# EAGLE design d_counter (EAGLE 7.6.0)

## Sheet 1 of 2
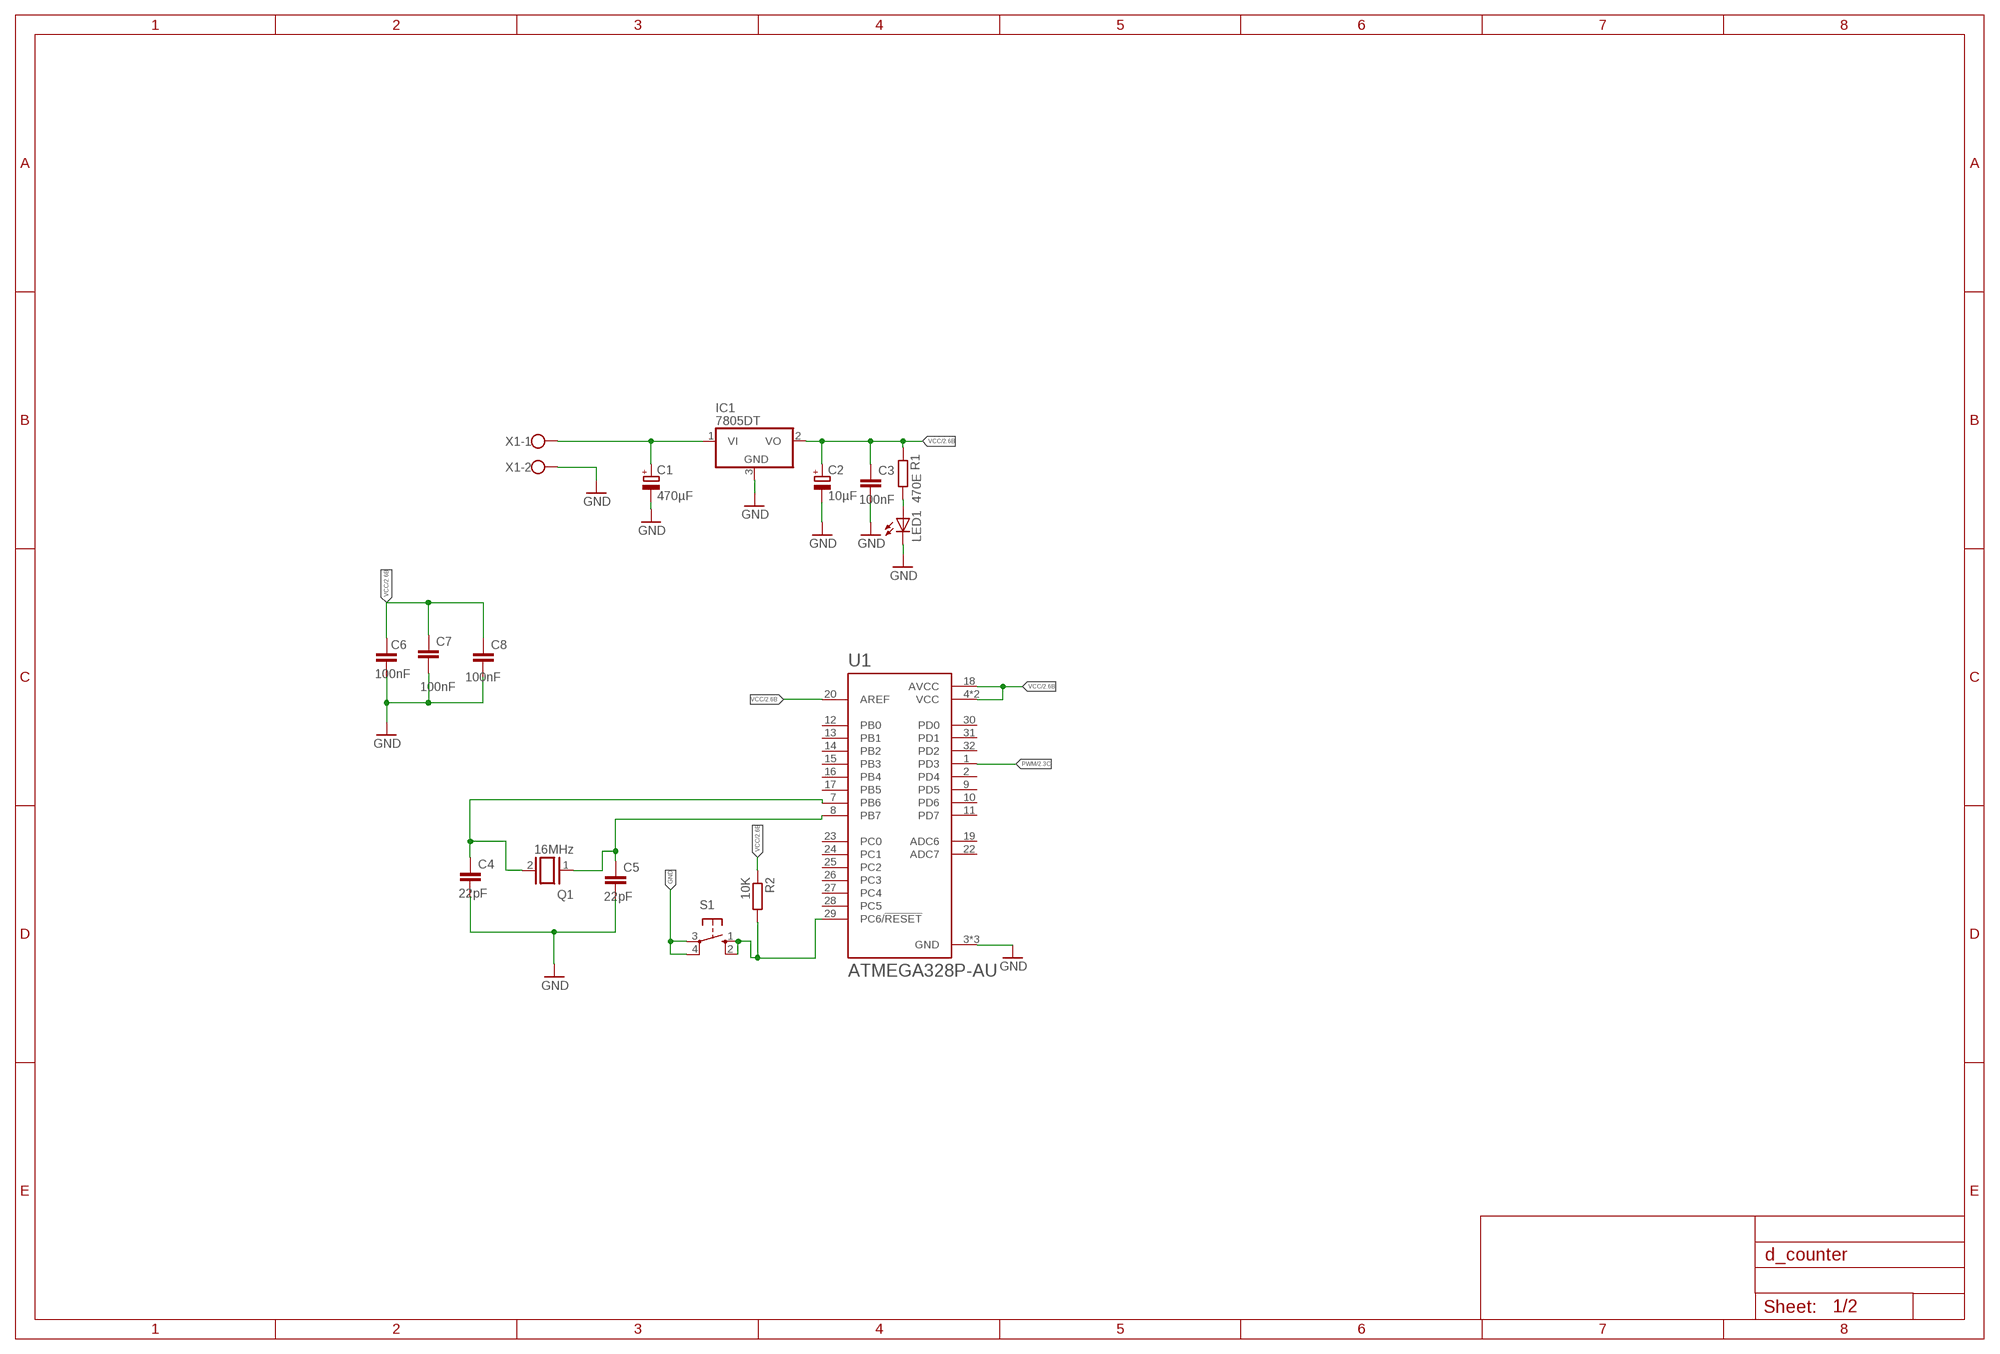
[diagram p0: schematic, sheet 1]

### Parts
C1  470µF  CPOL-EU150CLZ-1010  [150CLZ-1010]
C2  10µF  CPOL-EU150CLZ-1010  [150CLZ-1010]
C3  100nF  C-EUC1206  [C1206]
C4  22pF  C-EUC1206  [C1206]
C5  22pF  C-EUC1206  [C1206]
C6  100nF  C-EUC1206  [C1206]
C7  100nF  C-EUC1206  [C1206]
C8  100nF  C-EUC1206  [C1206]
IC1  7805DT  [TO252]
LED1  LEDSMT1206  [1206]
Q1  16MHz  XTAL/S  [QS]
R1  470E  R-EU_M1206  [M1206]
R2  10K  R-EU_R1206  [R1206]
S1  10-XX  [B3F-10XX]
U1  ATMEGA328P-AU  [QFP80P900X900X120-32N]
X1  W237-102  [W237-102]

### Nets
GND: C1.- C2.- C3.2 C4.2 C5.2 C6.2 C7.2 C8.2 IC1.3(GND) LED1.C S1.3(P) S1.4(P1) U1.3(GND) U1.5(GND) U1.21(GND) X1.2 ; also sheet 2
N$1: C1.+ IC1.1(VI) X1.1
N$2: LED1.A R1.2
N$3: C4.1 Q1.2 U1.7(PB6)
N$4: C5.1 Q1.1 U1.8(PB7)
N$6: R2.2 S1.1(S) S1.2(S1) U1.29(PC6/!RESET)
PWM: U1.1(PD3) ; also sheet 2
VCC: C2.+ C3.1 C6.1 C7.1 C8.1 IC1.2(VO) R1.1 R2.1 U1.4(VCC) U1.6(VCC) U1.18(AVCC) U1.20(AREF) ; also sheet 2
Unconnected: U1.2(PD4) U1.9(PD5) U1.10(PD6) U1.11(PD7) U1.12(PB0) U1.13(PB1) U1.14(PB2) U1.15(PB3) U1.16(PB4) U1.17(PB5) U1.19(ADC6) U1.22(ADC7) U1.23(PC0) U1.24(PC1) U1.25(PC2) U1.26(PC3) U1.27(PC4) U1.28(PC5) U1.30(PD0) U1.31(PD1) U1.32(PD2)

## Sheet 2 of 2
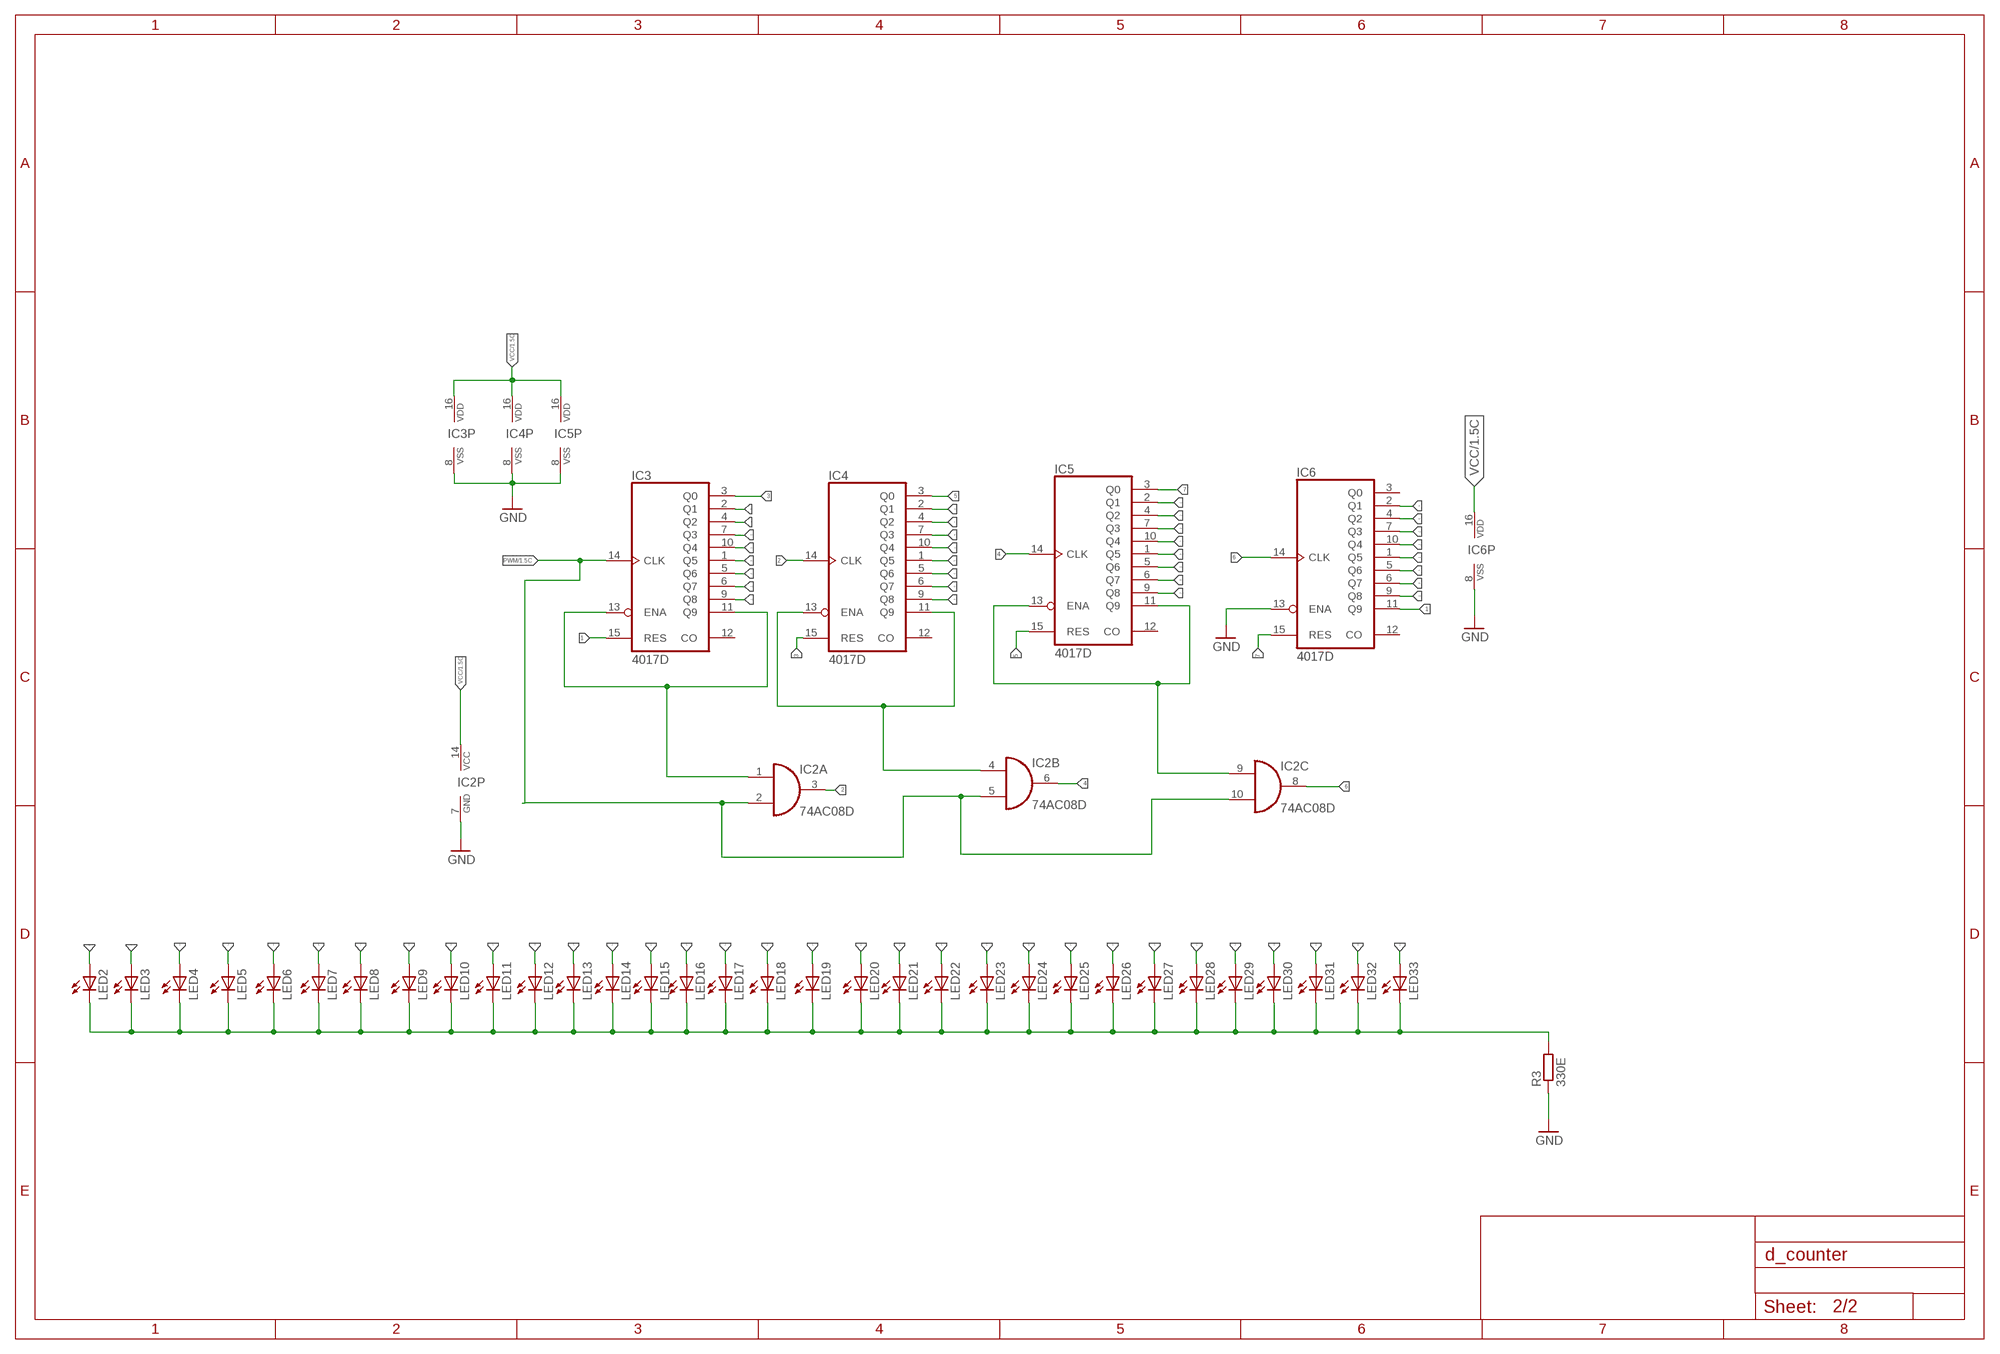
[diagram p1: schematic, sheet 2]

### Parts
IC2  74AC08D  [SO14]
IC3  4017D  [SO16]
IC4  4017D  [SO16]
IC5  4017D  [SO16]
IC6  4017D  [SO16]
LED2  LEDSML1206  [SML1206]
LED3  LEDSML1206  [SML1206]
LED4  LEDSML1206  [SML1206]
LED5  LEDSML1206  [SML1206]
LED6  LEDSML1206  [SML1206]
LED7  LEDSML1206  [SML1206]
LED8  LEDSML1206  [SML1206]
LED9  LEDSML1206  [SML1206]
LED10  LEDSML1206  [SML1206]
LED11  LEDSML1206  [SML1206]
LED12  LEDSML1206  [SML1206]
LED13  LEDSML1206  [SML1206]
LED14  LEDSML1206  [SML1206]
LED15  LEDSML1206  [SML1206]
LED16  LEDSML1206  [SML1206]
LED17  LEDSML1206  [SML1206]
LED18  LEDSML1206  [SML1206]
LED19  LEDSML1206  [SML1206]
LED20  LEDSML1206  [SML1206]
LED21  LEDSML1206  [SML1206]
LED22  LEDSML1206  [SML1206]
LED23  LEDSML1206  [SML1206]
LED24  LEDSML1206  [SML1206]
LED25  LEDSML1206  [SML1206]
LED26  LEDSML1206  [SML1206]
LED27  LEDSML1206  [SML1206]
LED28  LEDSML1206  [SML1206]
LED29  LEDSML1206  [SML1206]
LED30  LEDSML1206  [SML1206]
LED31  LEDSML1206  [SML1206]
LED32  LEDSML1206  [SML1206]
LED33  LEDSML1206  [SML1206]
R3  330E  R-EU_R1206  [R1206]

### Nets
1: IC3.15(RES) IC6.11(Q9)
2: IC2.3(A:O) IC4.14(CLK)
3: IC3.3(Q0) IC4.15(RES)
4: IC2.6(B:O) IC5.14(CLK)
5: IC4.3(Q0) IC5.15(RES)
6: IC2.8(C:O) IC6.14(CLK)
7: IC5.3(Q0) IC6.15(RES)
8: IC3.2(Q1) LED2.A
9: IC3.4(Q2) LED3.A
10: IC3.7(Q3) LED4.A
11: IC3.10(Q4) LED5.A
12: IC3.1(Q5) LED6.A
13: IC3.5(Q6) LED7.A
14: IC3.6(Q7) LED8.A
15: IC3.9(Q8) LED9.A
16: IC4.2(Q1) LED10.A
17: IC4.4(Q2) LED11.A
18: IC4.7(Q3) LED12.A
19: IC4.10(Q4) LED13.A
20: IC4.1(Q5) LED14.A
21: IC4.5(Q6) LED15.A
22: IC4.6(Q7) LED16.A
23: IC4.9(Q8) LED17.A
24: IC5.2(Q1) LED18.A
25: IC5.4(Q2) LED19.A
26: IC5.7(Q3) LED20.A
27: IC5.10(Q4) LED21.A
28: IC5.1(Q5) LED22.A
29: IC5.5(Q6) LED23.A
30: IC5.6(Q7) LED24.A
31: IC5.9(Q8) LED25.A
32: IC6.2(Q1) LED26.A
33: IC6.4(Q2) LED27.A
34: IC6.7(Q3) LED28.A
35: IC6.10(Q4) LED29.A
36: IC6.1(Q5) LED30.A
37: IC6.5(Q6) LED31.A
38: IC6.6(Q7) LED32.A
39: IC6.9(Q8) LED33.A
GND: IC2.7(P:GND) IC3.8(VSS) IC4.8(VSS) IC5.8(VSS) IC6.8(VSS) IC6.13(ENA) R3.1 ; also sheet 1
N$5: IC2.1(A:I0) IC3.11(Q9) IC3.13(ENA)
N$7: IC2.4(B:I0) IC4.11(Q9) IC4.13(ENA)
N$9: IC2.9(C:I0) IC5.11(Q9) IC5.13(ENA)
N$15: LED2.C LED3.C LED4.C LED5.C LED6.C LED7.C LED8.C LED9.C LED10.C LED11.C LED12.C LED13.C LED14.C LED15.C LED16.C LED17.C LED18.C LED19.C LED20.C LED21.C LED22.C LED23.C LED24.C LED25.C LED26.C LED27.C LED28.C LED29.C LED30.C LED31.C LED32.C LED33.C R3.2
PWM: IC2.2(A:I1) IC2.5(B:I1) IC2.10(C:I1) IC3.14(CLK) ; also sheet 1
VCC: IC2.14(P:VCC) IC3.16(VDD) IC4.16(VDD) IC5.16(VDD) IC6.16(VDD) ; also sheet 1
Unconnected: IC2.11(D:O) IC2.12(D:I0) IC2.13(D:I1) IC3.12(CO) IC4.12(CO) IC5.12(CO) IC6.3(Q0) IC6.12(CO)

## Library data of the parts
C1 C2 = resistor:CPOL-EU: POLARIZED CAPACITOR, European symbol
C3-C8 = rcl:C-EU: CAPACITOR, European symbol
IC1 = linear:78*: Positive VOLTAGE REGULATOR Source: http://cache.national.com/ds/LM/LM78L05.pdf http://www.fairchildsemi.com/ds/LM/LM7805.pdf
IC2 = 74xx-eu:74*08: Quad 2-input AND gate
IC3-IC6 = 40xx:4017: COUNTER/DIVIDER
LED1-LED33 = led:LED: LED OSRAM: - CHIPLED LG R971, LG N971, LY N971, LG Q971, LY Q971, LO R971, LY R971 LH N974, LH R974 LS Q976, LO Q976, LY Q976 LO Q996 - Hyper CHIPLED LW Q18S LB Q993, LB Q99A, LB R99A - SideLED LS A670, LO A670, LY A670, LG A670, LP A670 LB A673, LV A673, LT A673, LW A673 LH A674 LY A675 LS A676, LA A676, LO A676, LY A676, LW A676 LS A679, LY A679, LG A679 - Hyper Micro SIDELED® LS Y876, LA Y876, LO Y876, LY Y876 LT Y87S - SmartLED LW L88C, LW L88S LB L89C, LB L89S, LG L890 LS L89K, LO L89K, LY L89K LS L896, LA L896, LO L896, LY L896 - TOPLED LS T670, LO T670, LY T670, LG T670, LP T670 LSG T670, LSP T670, LSY T670, LOP T670, LYG T670 LG T671, LOG T671, LSG T671 LB T673, LV T673, LT T673, LW T673 LH T674 LS T676, LA T676, LO T676, LY T676, LB T676, LH T676, LSB T676, LW T676 LB T67C, LV T67C, LT T67C, LS T67K, LO T67K, LY T67K, LW E67C LS E67B, LA E67B, LO E67B, LY E67B, LB E67C, LV E67C, LT E67C LW T67C LS T679, LY T679, LG T679 LS T770, LO T770, LY T770, LG T770, LP T770 LB T773, LV T773, LT T773, LW T773 LH T774 LS E675, LA E675, LY E675, LS T675 LS T776, LA T776, LO T776, LY T776, LB T776 LHGB T686 LT T68C, LB T68C - Hyper Mini TOPLED® LB M676 - Mini TOPLED Santana® LG M470 LS M47K, LO M47K, LY M47K Source: http://www.osram.convergy.de LUXEON: - LUMILED® LXK2-PW12-R00, LXK2-PW12-S00, LXK2-PW14-U00, LXK2-PW14-V00 LXK2-PM12-R00, LXK2-PM12-S00, LXK2-PM14-U00 LXK2-PE12-Q00, LXK2-PE12-R00, LXK2-PE12-S00, LXK2-PE14-T00, LXK2-PE14-U00 LXK2-PB12-K00, LXK2-PB12-L00, LXK2-PB12-M00, LXK2-PB14-N00, LXK2-PB14-P00, LXK2-PB14-Q00 LXK2-PR12-L00, LXK2-PR12-M00, LXK2-PR14-Q00, LXK2-PR14-R00 LXK2-PD12-Q00, LXK2-PD12-R00, LXK2-PD12-S00 LXK2-PH12-R00, LXK2-PH12-S00 LXK2-PL12-P00, LXK2-PL12-Q00, LXK2-PL12-R00 Source: www.luxeon.com KINGBRIGHT: KA-3528ASYC Source: www.kingbright.com
Q1 = special:XTAL/S: CRYSTAL
R1 = resistor:R-EU_: RESISTOR, European symbol
R2 R3 = rcl:R-EU_: RESISTOR, European symbol
S1 = switch-omron:10-XX: OMRON SWITCH; MPN: B3F-1000; OC_FARNELL: 176432; OC_NEWARK: 36M3542
U1 = ATMEGA328P-AU:ATMEGA328P-AU: ATmega Series 20 MHz 32 KB Flash 2 KB SRAM 8-Bit Microcontroller - TQFP-32; AVAILABILITY: Unavailable; DESCRIPTION: Microcontroller Mcu, 8 Bit, Atmega, 20mhz, Tqfp-32; MF: Microchip; MP: ATMEGA328P-AU; PACKAGE: TQFP-32 Microchip; PRICE: None
X1 = con-wago-500:W237-102: WAGO SCREW CLAMP; MPN: 237-102; OC_FARNELL: unknown; OC_NEWARK: 70K9898

## Board
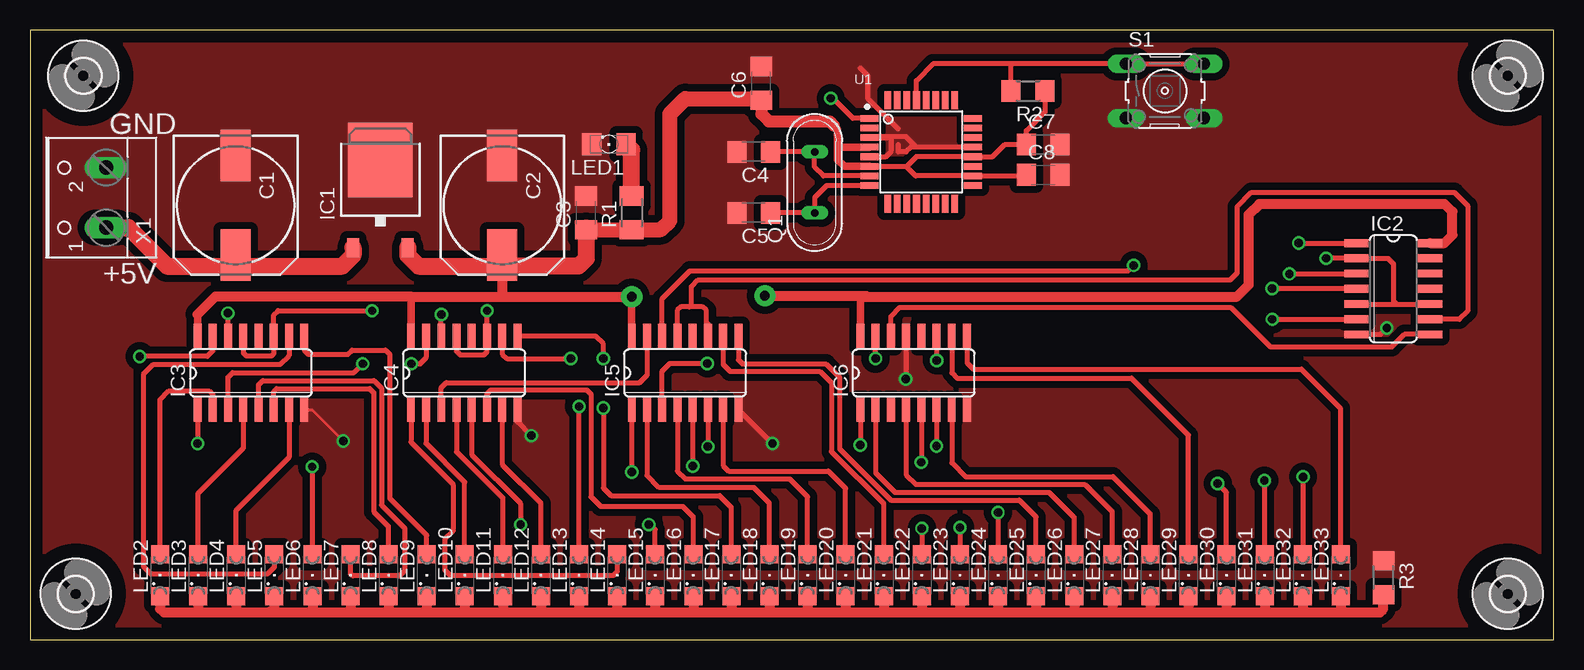
[diagram p2: board, top side]
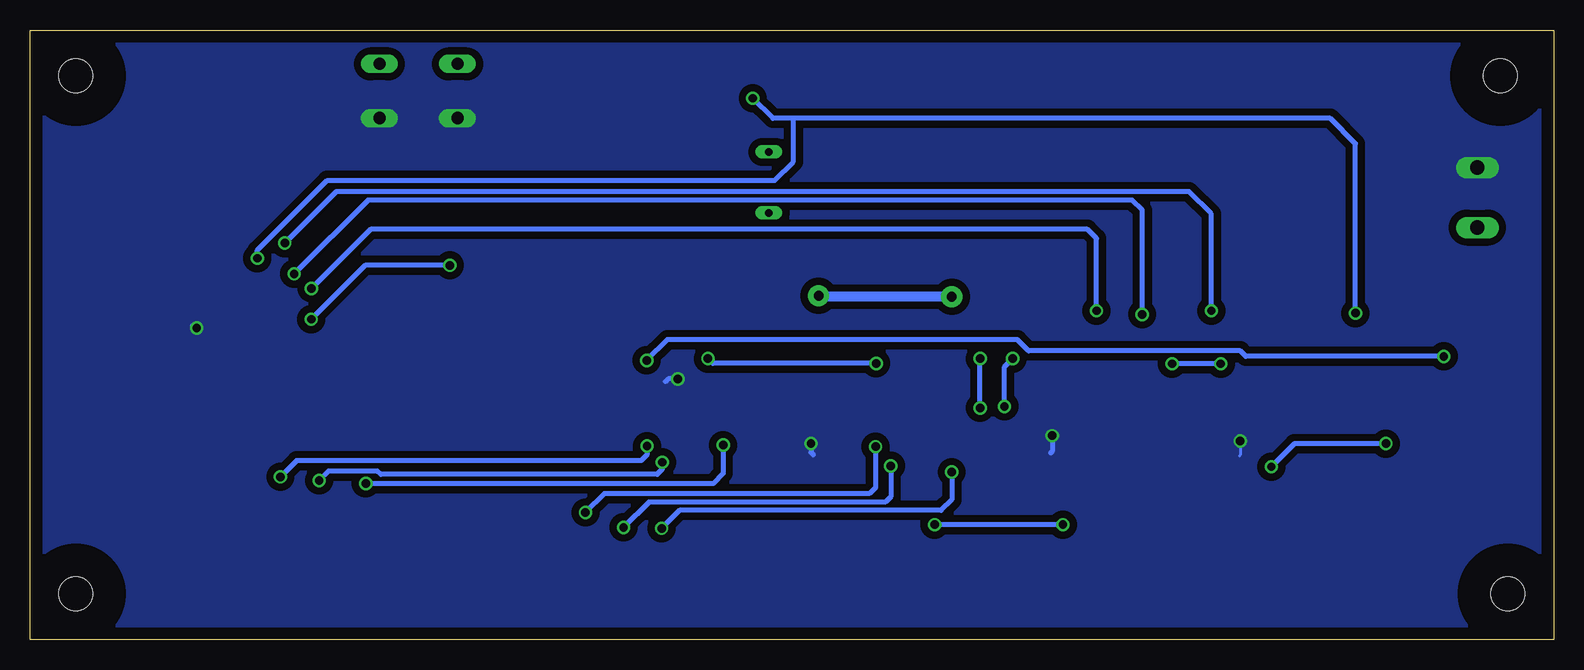
[diagram p3: board, bottom side, seen from below]

Size 127 x 50.8 mm. Coordinates in mm from the lower left corner, seen from the top.
Outline: 0,0 127,0 127,50.8 0,50.8 0,0
Copper layers (1*16): Top 0.035mm / dielectric 1.5mm / Bottom 0.035mm
Design rules "default": minimum track width 10mil, minimum drill 24mil, track to track 8mil, track to pad 8mil, pad to pad 8mil, via to via 8mil, smd to smd 8mil, copper to edge 40mil, drill to drill 8mil, minimum pad ring 10mil, minimum via ring 8mil, stop-mask expansion 4mil, vias tented up to drill 0mil, thermal gap 10mil

### Footprints (pad centres in the part's own frame; a part is rotated, then mirrored left to right if it is on the bottom)
150CLZ-1010 = smd 4.3 x 2.5: + 4.15,0; - -4.15,0
C1206 = smd 1.6 x 1.8: 1 -1.4,0; 2 1.4,0
TO252 = smd 1 x 1.6: 1 -2.28,-4.8; 2 2.28,-4.8 | smd 5.4 x 6.2: 3 0,2.5
SO14 = smd 0.66 x 2.032: 1 -3.81,-3.073; 2 -2.54,-3.073; 3 -1.27,-3.073; 4 0,-3.073; 5 1.27,-3.073; 6 2.54,-3.073; 7 3.81,-3.073; 8 3.81,3.073; 9 2.54,3.073; 10 1.27,3.073; 11 0,3.073; 12 -1.27,3.073; 13 -2.54,3.073; 14 -3.81,3.073
SO16 = smd 0.66 x 2.032: 1 -4.445,-3.073; 2 -3.175,-3.073; 3 -1.905,-3.073; 4 -0.635,-3.073; 5 0.635,-3.073; 6 1.905,-3.073; 7 3.175,-3.073; 8 4.445,-3.073; 9 4.445,3.073; 10 3.175,3.073; 11 1.905,3.073; 12 0.635,3.073; 13 -0.635,3.073; 14 -1.905,3.073; 15 -3.175,3.073; 16 -4.445,3.073
1206 = smd 1.6 x 1.803: A -1.422,0; C 1.422,0
SML1206 = smd 1.5 x 1.5: A 1.75,0; C -1.75,0
QS = drill 0.61 long: 1 -2.54,0; 2 2.54,0
M1206 = smd 1.6 x 2: 1 -1.4,0; 2 1.4,0
R1206 = smd 1.6 x 1.803: 1 -1.422,0; 2 1.422,0
B3F-10XX = drill 1.016 long: 1 -3.251,2.261; 2 3.251,2.261; 3 -3.251,-2.261; 4 3.251,-2.261
QFP80P900X900X120-32N = smd 1.5 x 0.55: 1 -4.3,2.8; 2 -4.3,2; 3 -4.3,1.2; 4 -4.3,0.4; 5 -4.3,-0.4; 6 -4.3,-1.2; 7 -4.3,-2; 8 -4.3,-2.8; 17 4.3,-2.8; 18 4.3,-2; 19 4.3,-1.2; 20 4.3,-0.4; 21 4.3,0.4; 22 4.3,1.2; 23 4.3,2; 24 4.3,2.8 | smd 0.55 x 1.5: 9 -2.8,-4.3; 10 -2,-4.3; 11 -1.2,-4.3; 12 -0.4,-4.3; 13 0.4,-4.3; 14 1.2,-4.3; 15 2,-4.3; 16 2.8,-4.3; 25 2.8,4.3; 26 2,4.3; 27 1.2,4.3; 28 0.4,4.3; 29 -0.4,4.3; 30 -1.2,4.3; 31 -2,4.3; 32 -2.8,4.3
2,8 = hole 2.8: 0,0
W237-102 = drill 1.194 long: 1 -2.5,-1.27; 2 2.5,-1.27

### Placement (x,y rotation side)
C1  17.14,36.2 270 top
C2  39.37,36.2 270 top
C3  46.35,35.56 90 top
C4  60.33,40.64 180 top
C5  60.33,35.56 180 top
C6  60.96,46.35 90 top
C7  84.45,41.27 0 top
C8  84.45,38.73 0 top
IC1  29.21,37.47 0 top
IC2  113.64,29.24 270 top
IC3  18.41,22.23 0 top
IC4  36.2,22.23 0 top
IC5  54.61,22.23 0 top
IC6  73.66,22.23 0 top
LED1  48.26,41.27 180 top
LED2  10.85,5.36 90 top
LED3  14.02,5.36 90 top
LED4  17.2,5.36 90 top
LED5  20.37,5.36 90 top
LED6  23.55,5.36 90 top
LED7  26.72,5.36 90 top
LED8  29.9,5.36 90 top
LED9  33.07,5.36 90 top
LED10  36.25,5.36 90 top
LED11  39.42,5.36 90 top
LED12  42.6,5.36 90 top
LED13  45.77,5.36 90 top
LED14  48.95,5.36 90 top
LED15  52.12,5.36 90 top
LED16  55.3,5.36 90 top
LED17  58.47,5.36 90 top
LED18  61.65,5.36 90 top
LED19  64.82,5.36 90 top
LED20  68,5.36 90 top
LED21  71.17,5.36 90 top
LED22  74.35,5.36 90 top
LED23  77.52,5.36 90 top
LED24  80.7,5.36 90 top
LED25  83.87,5.36 90 top
LED26  87.05,5.36 90 top
LED27  90.22,5.36 90 top
LED28  93.4,5.36 90 top
LED29  96.57,5.36 90 top
LED30  99.75,5.36 90 top
LED31  102.92,5.36 90 top
LED32  106.1,5.36 90 top
LED33  109.27,5.36 90 top
Q1  65.41,38.1 90 top
R1  50.16,35.56 90 top
R2  83.19,45.72 180 top
R3  112.83,5.16 270 top
S1  94.61,45.72 0 top
U1  74.3,40.64 0 top
U$1  [2,8]  4.45,46.99 0 top
U$2  [2,8]  123.19,46.99 0 top
U$3  [2,8]  123.19,3.81 0 top
U$5  [2,8]  3.81,3.81 0 top
X1  5.08,36.83 90 top

### Tracks (layer width: path | path; a pad name or v marks a point on that pad's centre or on a via)
1  (via drill 0.7 pad 0.25)
  Top 0.406: IC3.15 15.24,24.05 14.78,23.6 v9.14,23.6 | v75.59,23.27 75.59,25.27 IC6.11
  Bottom 0.406: v9.14,23.6 25.65,23.6 26.11,24.05 43.76,24.05 44.7,24.99 73.86,24.99 v75.59,23.27
2  (via drill 0.7 pad 0.25)
  Top 0.406: IC4.14 v34.29,27.1 | v104.98,30.48 110.54,30.48 IC2.3
  Bottom 0.406: v34.29,27.1 34.29,35.79 35.13,36.63 98.83,36.63 v104.98,30.48
3  (via drill 0.7 pad 0.25)
  Top 0.406: IC3.3 16.51,21.87 16.89,22.25 27,22.25 v27.74,22.99 | v31.8,22.99 32.54,22.99 33.02,23.47 IC4.15
  Bottom 0.406: v27.74,22.99 v31.8,22.99
4  (via drill 0.7 pad 0.25)
  Top 0.406: v103.56,26.7 IC2.6 | IC5.14 52.7,28.42 55.02,30.73 91.54,30.73 v92,31.19
  Bottom 0.406: v92,31.19 99.06,31.19 v103.56,26.7
5
  Top 0.406: IC4.3 34.29,21.01 34.7,21.41 50.83,21.41 51.44,22.02 IC5.15
6
  Top 0.406: IC6.14 71.75,26.92 72.52,27.69 100.1,27.69 103.4,24.38 113.54,24.38 114.58,25.43 IC2.8
7  (via drill 0.7 pad 0.25)
  Top 0.406: IC5.3 52.7,22.38 53.34,23.01 v56.46,23.01 | v70.48,23.42 IC6.15
  Bottom 0.406: v56.46,23.01 70.08,23.01 v70.48,23.42
8
  Top 0.406: LED2.A 10.85,19.99 11.58,20.73 14.94,20.73 15.24,20.42 IC3.2
9
  Top 0.406: LED3.A 14.02,12.19 17.78,15.95 IC3.4
10
  Top 0.406: LED4.A 17.2,10.79 21.59,15.19 IC3.7
11
  Top 0.406: LED5.A 20.37,6.04 19.81,5.49 10.06,5.49 9.45,6.1 9.45,22.1 10.29,22.94 20.85,22.94 21.59,23.67 IC3.10
12  (via drill 0.7 pad 0.25)
  Top 0.406: IC3.1 v13.97,16.33 | v23.52,14.4 23.52,7.13 LED6.A
  Bottom 0.406: v13.97,16.33 21.59,16.33 v23.52,14.4
13
  Top 0.406: IC3.5 19.05,21.23 19.41,21.59 28.68,21.59 29.31,20.95 29.31,11.2 31.24,9.27 31.24,5.74 30.81,5.31 26.9,5.31 26.72,5.49 LED7.A
14
  Top 0.406: LED8.A 29.87,7.13 29.87,9.45 28.65,10.67 28.65,20.57 28.32,20.9 20.55,20.9 20.32,20.68 IC3.6
15
  Top 0.406: LED9.A 33.07,8.69 30.34,11.42 30,11.76 30,23.77 29.64,24.13 26.85,24.13 26.49,23.77 23.19,23.77 22.86,24.11 IC3.9
16
  Top 0.406: LED10.A 36.25,13.13 33.02,16.36 IC4.2
17
  Top 0.406: IC4.4 35.56,15.65 39.42,11.79 LED11.A
18
  Top 0.406: IC4.7 39.37,14.58 42.6,11.35 LED12.A
19  (via drill 0.7 pad 0.25)
  Top 0.406: IC4.10 39.37,23.8 39.75,23.42 44.55,23.42 v45.09,23.42 | LED13.A v45.77,19.43
  Bottom 0.406: v45.77,19.43 45.77,22.73 v45.09,23.42
20
  Top 0.406: IC4.1 31.75,16.46 35.26,12.95 35.26,9.04 34.57,8.36 34.57,5.82 35.03,5.36 48.64,5.36 48.95,5.66 LED14.A
21  (via drill 0.7 pad 0.25)
  Top 0.406: IC4.5 36.83,15.42 40.89,11.35 v40.89,9.58 | v51.59,9.58 51.71,9.58 52.12,9.17 LED15.A
  Bottom 0.406: v40.89,9.58 v51.59,9.58
22
  Top 0.406: IC4.6 38.1,20.47 38.43,20.8 46.41,20.8 46.76,20.45 46.76,11.89 47.55,11.1 54.41,11.1 55.3,10.21 LED16.A
23  (via drill 0.7 pad 0.25)
  Top 0.406: v47.8,23.42 47.8,24.64 47.14,25.3 IC4.9 | v47.8,19.3 47.8,12.62 48.44,11.99 57.48,11.99 58.47,11 LED17.A
  Bottom 0.406: v47.8,19.3 v47.8,23.42
24
  Top 0.406: LED18.A 61.65,11.38 60.35,12.68 52.45,12.68 51.44,13.69 IC5.2
25
  Top 0.406: IC5.4 53.98,14.05 54.63,13.39 63.32,13.39 64.82,11.89 LED19.A
26
  Top 0.406: IC5.7 57.78,14.5 58.24,14.05 66.55,14.05 68,12.6 LED20.A
27
  Top 0.406: IC5.10 57.78,22.94 58.37,22.35 65.84,22.35 66.8,21.39 66.8,15.67 71.17,11.3 LED21.A
28  (via drill 0.7 pad 0.25)
  Top 0.406: IC5.1 v50.16,13.97 | v74.35,9.27 LED22.A
  Bottom 0.406: v50.16,13.97 50.16,11.66 51.05,10.77 72.85,10.77 v74.35,9.27
29  (via drill 0.7 pad 0.25)
  Top 0.406: IC5.5 v55.24,14.48 | v77.52,9.35 LED23.A
  Bottom 0.406: v55.24,14.48 55.24,11.91 55.7,11.46 75.41,11.46 v77.52,9.35
30  (via drill 0.7 pad 0.25)
  Top 0.406: IC5.6 v56.52,16.08 | v80.7,10.59 LED24.A
  Bottom 0.406: v56.52,16.08 56.52,12.68 57.02,12.17 79.12,12.17 v80.7,10.59
31
  Top 0.406: IC5.9 59.05,23.32 59.38,22.99 66.34,22.99 67.49,21.84 67.49,15.9 71.75,11.63 82.47,11.63 83.87,10.24 LED25.A
32
  Top 0.406: IC6.2 70.48,13.89 72.11,12.27 84.94,12.27 87.05,10.16 LED26.A
33
  Top 0.406: IC6.4 73.03,13.74 73.84,12.93 87.94,12.93 90.22,10.64 LED27.A
34
  Top 0.406: IC6.7 76.83,14.73 77.98,13.59 90.27,13.59 93.4,10.46 LED28.A
35
  Top 0.406: IC6.10 76.83,22.23 77.27,21.79 91.82,21.79 96.57,17.04 LED29.A
36  (via drill 0.7 pad 0.25)
  Top 0.406: IC6.1 v69.22,16.2 | LED30.A 99.75,12.27 v99.01,13.01
  Bottom 0.406: v69.22,16.2 69.22,13.84 70.05,13.01 v99.01,13.01
37  (via drill 0.7 pad 0.25)
  Top 0.406: IC6.5 v74.3,14.78 | v102.89,13.26 102.89,7.13 LED31.A
  Bottom 0.406: v74.3,14.78 74.3,14.2 74.73,13.77 97.77,13.77 98.04,14.05 102.11,14.05 v102.89,13.26
38  (via drill 0.7 pad 0.25)
  Top 0.406: IC6.6 v75.56,16.13 | v106.12,13.56 106.12,7.13 LED32.A
  Bottom 0.406: v75.56,16.13 75.56,15.39 76.05,14.91 104.78,14.91 v106.12,13.56
39
  Top 0.406: IC6.9 78.11,23.06 78.64,22.53 105.99,22.53 109.25,19.28 109.25,7.13 LED33.A
GND  (via drill 0.7 pad 0.25)
  Top 0.254: IC3.8 23.52,19.15 v26.11,16.56
  Top 0.406: 71.75,41.91 73.03,41.91 73.89,41.04 U1.21 73.42,41.04 73.03,40.64 72.39,40.64 72.39,41.27 | 71.75,41.91 70.06,41.91 U1.3 71.69,41.84 71.75,41.91 | 71.75,41.91 71.75,40.64 71.36,40.24 U1.5 | 69.22,47.62 69.85,46.99 69.85,45.09 72.39,42.55 | IC5.8 59.08,19.15 v61.9,16.33 | IC4.8 40.64,18.14 v41.78,16.99 | IC2.7 112.57,25.43 v113.11,25.96 | IC6.13 73.03,21.74 v73,21.72
  Bottom 0.254: v26.11,16.56 26.11,15.39 26.19,15.32
  Bottom 0.406: v61.9,16.33 61.9,15.6 61.7,15.39 | v41.78,16.99 41.78,15.7 41.94,15.54 | v113.11,25.96 113.26,25.96 113.46,26.16 | v73,21.72 73.81,21.72 74.04,21.49
  pour Top (isolate 0.61, no thermals): 0.64,50.16 126.36,50.16 126.36,0.64 0.64,0.64
  pour Bottom (isolate 0.61, no thermals): 0.64,50.16 126.36,50.16 126.36,48.9 126.36,0.64 0.64,0.64
N$1
  Top 0.406: C1.+ 17.14,31.39 16.87,31.11
  Top 1.422: X1.1 8.21,34.33 11.43,31.11 16.87,31.11 26.04,31.11 26.93,32.01 IC1.1
N$2
  Top 1.422: R1.2 50.16,40.79 LED1.A
N$3
  Top 0.406: U1.7 66.14,38.64 65.41,39.37 Q1.2 C4.1
N$4
  Top 0.406: U1.8 66.42,37.84 65.41,36.83 Q1.1 C5.1
N$5  (via drill 0.7 pad 0.25)
  Top 0.406: IC3.13 17.78,23.9 18.03,23.65 20.14,23.65 20.32,23.82 IC3.11 20.32,27.05 20.68,27.41 v28.52,27.41 | v105.77,33.05 IC2.1
  Bottom 0.406: v28.52,27.41 28.52,35.48 30.38,37.34 101.47,37.34 v105.77,33.05
N$6
  Top 0.406: S1.2 S1.1 81.92,47.98 | 81.92,47.98 75.29,47.98 73.89,46.59 U1.29 | R2.2 81.76,47.83 81.92,47.98
N$7  (via drill 0.7 pad 0.25)
  Top 0.406: IC4.13 35.56,24.03 35.87,23.72 37.85,23.72 38.1,23.98 IC4.11 v38.1,27.41 | v103.53,29.26 103.56,29.23 IC2.4
  Bottom 0.406: v38.1,27.41 38.1,33.43 38.86,34.19 98.6,34.19 103.17,29.62 v103.53,29.26
N$9
  Top 0.406: 54.97,27.74 56.08,27.74 56.39,27.43 56.39,24.99 56.52,25.12 IC5.11 56.52,26.34 | 54.97,27.74 54.25,27.74 53.95,27.43 53.95,25.32 IC5.13 | 54.97,27.74 55.14,27.91 55.14,29.41 55.7,29.97 100.05,29.97 100.64,30.56 100.64,36.07 101.83,37.26 118.75,37.26 119.84,36.17 119.84,27.38 119.15,26.7 IC2.9
N$15
  Top 0.813: LED2.C 10.85,2.56 11.15,2.26 14.2,2.26 | 14.2,2.26 17.4,2.26 | 17.4,2.26 20.04,2.26 | 20.04,2.26 23.39,2.26 | 23.39,2.26 26.7,2.26 | 26.7,2.26 29.95,2.26 | 29.95,2.26 33.17,2.26 | 33.17,2.26 36.02,2.26 | 36.02,2.26 39.27,2.26 | 39.27,2.26 42.49,2.26 | 42.49,2.26 45.77,2.26 | 45.77,2.26 49.12,2.26 | 49.12,2.26 52.09,2.26 | 52.09,2.26 55.3,2.26 | 55.3,2.26 58.57,2.26 | 58.57,2.26 61.72,2.26 | 61.72,2.26 64.95,2.26 | 64.95,2.26 67.94,2.26 | 67.94,2.26 71.25,2.26 | 71.25,2.26 74.32,2.26 | 74.32,2.26 77.42,2.26 | 77.42,2.26 80.7,2.26 | 80.7,2.26 83.92,2.26 | 83.92,2.26 86.87,2.26 | 86.87,2.26 90.19,2.26 | 90.19,2.26 93.37,2.26 | 93.37,2.26 96.57,2.26 | 96.57,2.26 99.85,2.26 | 99.85,2.26 103.05,2.26 | 103.05,2.26 105.99,2.26 | 105.99,2.26 109.14,2.26 | 109.14,2.26 112.52,2.26 112.8,2.54 112.8,3.71 R3.2 | LED3.C 14.02,2.44 14.2,2.26 | LED4.C 17.2,2.46 17.4,2.26 | LED5.C 20.37,2.59 20.04,2.26 | LED6.C 23.55,2.41 23.39,2.26 | LED7.C 26.72,2.29 26.7,2.26 | LED8.C 29.9,2.31 29.95,2.26 | LED9.C 33.07,2.36 33.17,2.26 | LED10.C 36.25,2.49 36.02,2.26 | LED11.C 39.42,2.41 39.27,2.26 | LED12.C 42.6,2.36 42.49,2.26 | LED13.C 45.77,2.26 | LED14.C 48.95,2.44 49.12,2.26 | LED15.C 52.12,2.29 52.09,2.26 | LED16.C 55.3,2.26 | LED17.C 58.47,2.36 58.57,2.26 | LED18.C 61.65,2.34 61.72,2.26 | LED19.C 64.82,2.39 64.95,2.26 | LED20.C 68,2.31 67.94,2.26 | LED21.C 71.17,2.34 71.25,2.26 | LED22.C 74.35,2.29 74.32,2.26 | LED23.C 77.52,2.36 77.42,2.26 | LED24.C 80.7,2.26 | LED25.C 83.87,2.31 83.92,2.26 | LED26.C 87.05,2.44 86.87,2.26 | LED27.C 90.22,2.29 90.19,2.26 | LED28.C 93.4,2.29 93.37,2.26 | LED29.C 96.57,2.26 | LED30.C 99.75,2.36 99.85,2.26 | LED31.C 102.92,2.39 103.05,2.26 | LED32.C 106.1,2.36 105.99,2.26
  Top 0.813: LED33.C 109.27,2.39 109.14,2.26
PWM  (via drill 0.7 pad 0.25)
  Top 0.406: IC3.14 v16.51,27.2 | U1.1 68.6,43.44 66.93,45.11 v66.75,45.11 | IC2.5 113.92,27.96 | 113.92,27.96 IC2.10 | 113.92,27.96 113.67,28.22 113.67,31.32 113.21,31.77 IC2.2 v108.05,31.77
  Bottom 0.406: v16.51,27.2 16.51,41.33 18.62,43.43 63.5,43.43 | 63.5,43.43 65.08,43.43 v66.75,45.11 | v108.05,31.77 108.05,32.44 102.21,38.28 64.92,38.28 63.37,39.83 63.37,43.31 63.5,43.43
VCC  (via drill 0.8 pad 1.78)
  Top 0.406: U1.6 73.03,39.44 | 73.03,39.44 73.09,39.44 73.89,40.24 U1.20 80.25,40.24 81.28,41.27 C7.1 83.06,42.41 84.61,43.97 R2.1 | C8.1 82.96,38.64 U1.18 73.83,38.64 73.03,39.44
  Top 0.61: U1.6 67.88,39.44 67.31,40.01 67.31,41.27 | 67.31,41.27 67.31,42.55 66.99,42.86 | U1.4 67.55,41.04 67.31,41.27 | IC4.16 31.75,28.57 | IC5.16 v50.16,28.57 | IC6.16 69.22,28.57 | 32.38,31.11 39.37,31.11 | IC3.16 13.97,27.1
  Top 0.813: 39.37,28.57 31.75,28.57 15.44,28.57 13.97,27.1 | 39.37,28.57 v50.16,28.57 | 69.22,28.57 69.8,28.57 | 69.8,28.57 100.61,28.57 100.69,28.65 101.58,29.54 101.58,35.41 102.46,36.3 117.93,36.3 118.57,35.66 118.57,33.71 117.91,33.05 IC2.14 | 39.37,31.11 39.37,28.57 | v61.27,28.65 69.72,28.65 69.8,28.57
  Top 1.016: C6.1 60.96,43.81 61.59,43.18 66.67,43.18 66.99,42.86
  Top 1.27: C3.1 R1.1 52.58,34.16 53.34,34.92 53.34,43.81 54.61,45.09 60.83,45.09 C6.1
  Top 1.422: IC1.2 31.49,32.01 32.38,31.11 38.44,31.11 38.91,31.58 | 38.91,31.58 C2.+ | 46.35,34.29 C3.1 46.35,31.75 45.72,31.11 39.37,31.11 38.91,31.58
  Bottom 0.813: v50.16,28.57 61.19,28.57 v61.27,28.65

### Text on the board
tNames: GND | +5V